# Altium schematic sheet supply.SchDoc
size A4; SheetNumber: 2; SheetTotal: 9
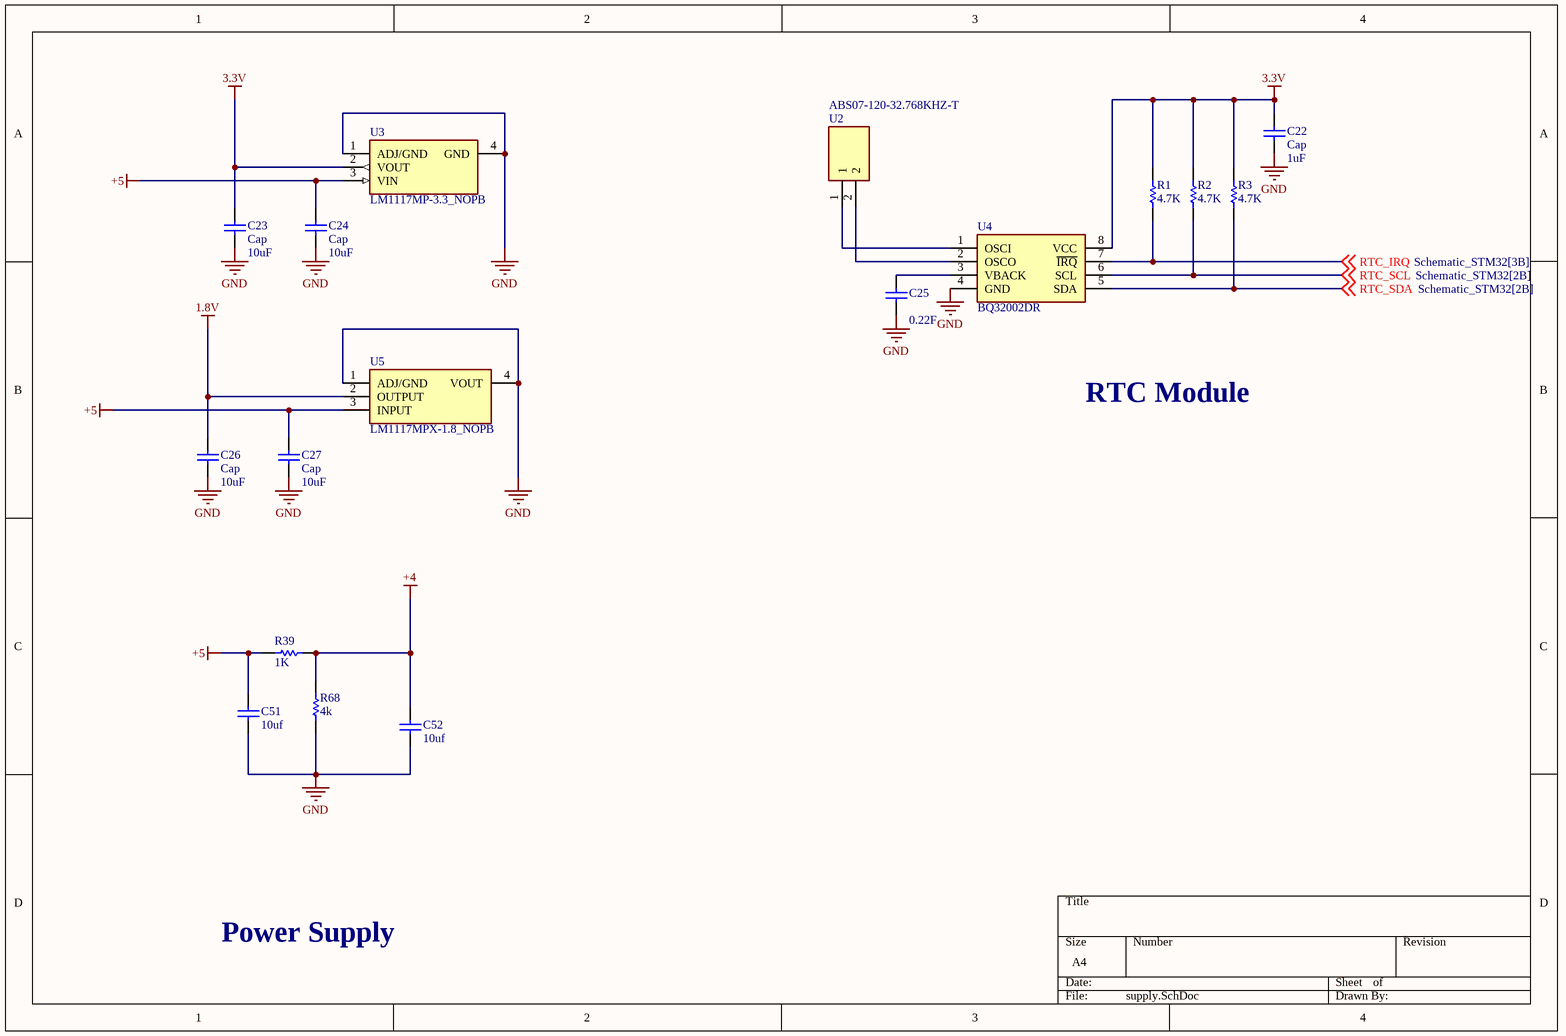
[diagram p0: supply.SchDoc]

## Parts
C22  Cap  value 1uF  [RAD-0.3]
C23  Cap  value 10uF  [RAD-0.3]
C24  Cap  value 10uF  [RAD-0.3]
C25  value 0.22F  [RAD-0.3]  (hidden comment: Cap)
C26  Cap  value 10uF  [RAD-0.3]
C27  Cap  value 10uF  [RAD-0.3]
C51  value 10uf  (hidden comment: Capacitor)
C52  value 10uf  (hidden comment: Capacitor)
R1  value 4.7K  [AXIAL-0.3]  (hidden comment: Res1)
R2  value 4.7K  [AXIAL-0.3]  (hidden comment: Res1)
R3  value 4.7K  [AXIAL-0.3]  (hidden comment: Res1)
R39  value 1K  (hidden comment: Resistor)
R68  value 4k  (hidden comment: Resistor)
U2  ABS07-120-32.768KHZ-T  [ABS-07]
U3  LM1117MP-3.3_NOPB  [SOT230P700X180-4N]
U4  BQ32002DR  [SOIC127P600X175-8N]
U5  LM1117MPX-1.8_NOPB  [SOT230P700X180-4N]

## Nets
1.8V: C26.2 U5.2(OUTPUT)
3.3V: C22.2 C23.2 R1.1 R2.1 R3.1 U3.2(VOUT) U4.8(VCC)
+4: C52.2 R39.2 R68.2
+5: C24.2 C27.2 C51.2 R39.1 U3.3(VIN) U5.3(INPUT)
GND: C22.1 C23.1 C24.1 C25.1 C26.1 C27.1 C51.1 C52.1 R68.1 U3.1(ADJ/GND) U3.4(GND) U4.4(GND) U5.1(ADJ/GND) U5.4(VOUT)
RTC_IRQ: R1.2 U4.7(~{IRQ}) ; off-sheet RTC_IRQ
RTC_SCL: R2.2 U4.6(SCL) ; off-sheet RTC_SCL
RTC_SDA: R3.2 U4.5(SDA) ; off-sheet RTC_SDA
NetC25_2: C25.2 U4.3(VBACK)
NetU2_1: U2.1 U4.1(OSCI)
NetU2_2: U2.2 U4.2(OSCO)

## Notes on the sheet
- RTC Module
- Power Supply

## Library data of the parts
C22-C27 = Cap: Capacitor; Published: 8-Jun-2000; LatestRevisionDate: 17-Jul-2002; LatestRevisionNote: Re-released for DXP Platform.; PackageReference: RAD-0.3; Publisher: Altium Limited; PackageDescription: Radial Cap, Thru-Hole; 2 Leads; 0.3 in Pin Spacing
C51 C52 = Capacitor: SimulationGenericComponent: True
R1-R3 = Res1: Resistor; Published: 8-Jun-2000; LatestRevisionDate: 17-Jul-2002; LatestRevisionNote: Re-released for DXP Platform.; PackageReference: AXIAL-0.3; Publisher: Altium Limited; PackageDescription: Axial Device, Thru-Hole; 2 Leads; 0.3 in Pin Spacing
R39 R68 = Resistor: TC1: 0; SimulationGenericComponent: True; TC2: 0
U2 = ABS07-120-32.768KHZ-T: Crystal or Oscillator; Manufacturer_Name: ABRACON; Datasheet Link: http://www.abracon.com/Resonators/ABS07-120-32.768kHz-T.pdf; Manufacturer_Part_Number: ABS07-120-32.768KHZ-T; Mouser Part Number: 815-ABS0712032.768KT; Mouser Price/Stock: https://www.mouser.co.uk/ProductDetail/ABRACON/ABS07-120-32768KHZ-T?qs=z9S2%252BbP5pWhyNaQ4AovDCg%3D%3D; RS Part Number: 1712688P; RS Price/Stock: http://uk.rs-online.com/web/p/products/1712688P
U3 = LM1117MP-3.3_NOPB: Integrated Circuit; Manufacturer_Name: Texas Instruments; Manufacturer_Part_Number: LM1117MP-3.3/NOPB; Datasheet Link: http://docs-emea.rs-online.com/webdocs/0780/0900766b807800d2.pdf; Height: 1.8mm; Mouser Part Number: 926-LM1117MP-3.3NOPB; Mouser Price/Stock: https://www.mouser.com/Search/Refine.aspx?Keyword=926-LM1117MP-3.3NOPB; RS Part Number: 5339577P; RS Price/Stock: http://uk.rs-online.com/web/p/products/5339577P
U4 = BQ32002DR: Integrated Circuit; Manufacturer_Name: Texas Instruments; Datasheet Link: http://www.ti.com/lit/gpn/bq32002; Height: 1.75mm; Manufacturer_Part_Number: BQ32002DR; Mouser Part Number: 595-BQ32002DR; Mouser Price/Stock: https://www.mouser.com/Search/Refine.aspx?Keyword=595-BQ32002DR
U5 = LM1117MPX-1.8_NOPB: Integrated Circuit; Manufacturer_Name: Texas Instruments; Manufacturer_Part_Number: LM1117MPX-1.8/NOPB; Datasheet Link: http://www.ti.com/lit/gpn/lm1117; Height: 1.8mm; Mouser Part Number: 926-LM1117MPX1.8NOPB; Mouser Price/Stock: https://www.mouser.com/Search/Refine.aspx?Keyword=926-LM1117MPX1.8NOPB